# Altium schematic sheet SolenoidValveDriver_v01_Schematic.SchDoc: I2C Solenoid Valve Driver
size A4; URL: sasakaranovic.com/projects/diy-house-plants-watering-system-part-2-central-unit; Distributor: DigiKey
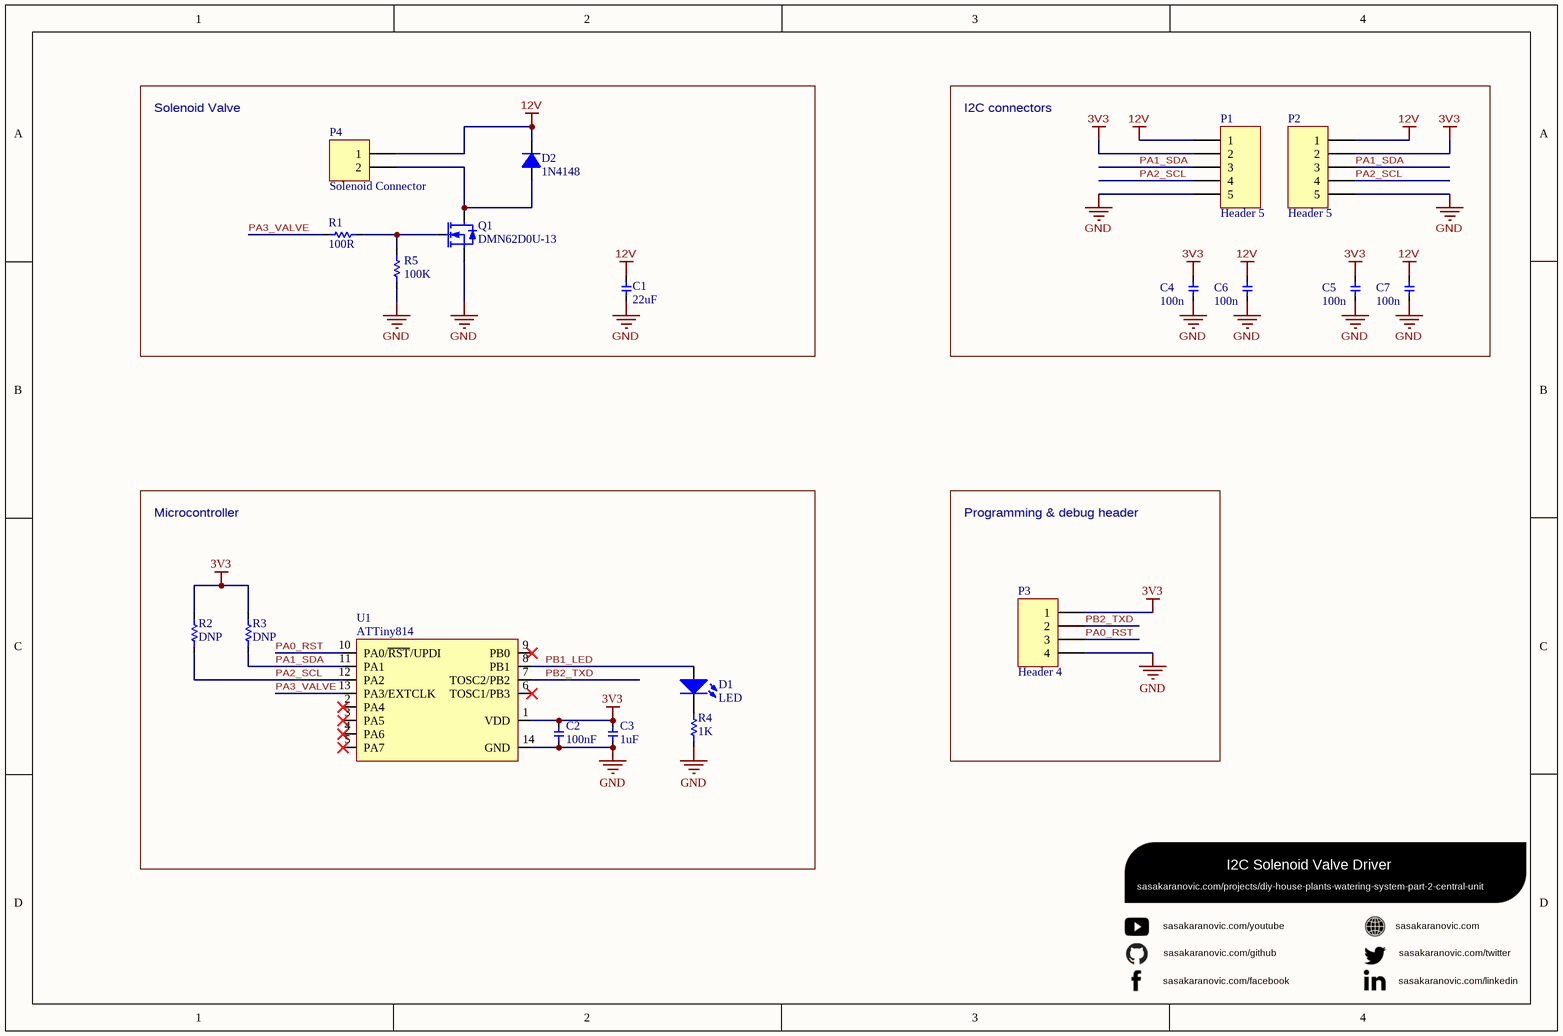
[diagram p0: SolenoidValveDriver_v01_Schematic.SchDoc]

## Parts
C1  value 22uF  [0603 - CAP]  (hidden comment: Cap)
C2  value 100nF  [0603 - CAP]  (hidden comment: Cap)
C3  value 1uF  [0603 - CAP]  (hidden comment: Cap)
C4  value 100n  [0603 - CAP]  (hidden comment: Cap)
C5  value 100n  [0603 - CAP]  (hidden comment: Cap)
C6  value 100n  [0603 - CAP]  (hidden comment: Cap)
C7  value 100n  [0603 - CAP]  (hidden comment: Cap)
D1  LED  [0603 Diode]
D2  1N4148  [SOD123]
P1  Header 5  [Header 5x1]
P2  Header 5  [Header 5x1]
P3  Header 4  [Header 4x1]  (no BOM)
P4  Solenoid Connector  [Header 2x1]
Q1  DMN62D0U-13  [SOT90P240X100-3N]
R1  value 100R  [0603]  (hidden comment: Res)
R2  value DNP  [0603]  (hidden comment: Res)  (no BOM)
R3  value DNP  [0603]  (hidden comment: Res)  (no BOM)
R4  value 1K  [0603]  (hidden comment: Res)
R5  value 100K  [0603]  (hidden comment: Res)
U1  ATTiny814  [SOIC127P600X175-14N]

## Blocks framed on the sheet
Solenoid Valve: C1 D2 P4 Q1 R1 R5
I2C connectors: C4-C7 P1 P2
Microcontroller: C2 C3 D1 R2-R4 U1
Programming & debug header: P3

## Nets
3V3: C2.2 C3.2 C4.2 C5.2 P1.2 P2.2 P3.1 R2.2 R3.2 U1.1(VDD)
12V: C1.2 C6.2 C7.2 D2.K P1.1 P2.1 P4.1
GND: C1.1 C2.1 C3.1 C4.1 C5.1 C6.1 C7.1 P1.5 P2.5 P3.4 Q1.2(S) R4.1 R5.1 U1.14(GND)
PA0_RST: P3.3 U1.10(PA0/~{RST}/UPDI)
PA1_SDA: P1.3 P2.3 R3.1 U1.11(PA1)
PA2_SCL: P1.4 P2.4 R2.1 U1.12(PA2)
PA3_VALVE: R1.1 U1.13(PA3/EXTCLK)
PB1_LED: D1.A U1.8(PB1)
PB2_TXD: P3.2 U1.7(TOSC2/PB2)
NetD1_K: D1.K R4.2
NetD2_A: D2.A P4.2 Q1.3(D)
NetQ1_1: Q1.1(G) R1.2 R5.2

Not connected (* = marked no-connect by the designer): U1 2(PA4)* 3(PA5)* 4(PA6)* 5(PA7)* 6(TOSC1/PB3)* 9(PB0)*

## Notes on the sheet
- sasakaranovic.com/youtube
- sasakaranovic.com
- sasakaranovic.com/github
- sasakaranovic.com/facebook
- sasakaranovic.com/twitter
- sasakaranovic.com/linkedin

## Library data of the parts
C1 = Cap: Capacitor; Manufacturer: Nichicon; Manufacturer Part Number: UVZ1J220MDD1TD; Distributor Part Number: 493-13481-1-ND; Distributor: DigiKey
C2 = Cap: Capacitor; Manufacturer: Samsung Electro-Mechanics; Manufacturer Part Number: CL10B104KB8NNNL; Distributor Part Number: 1276-CL10B104KB8NNNLCT-ND; Distributor: DigiKey
C3 = Cap: Capacitor; Manufacturer: Samsung Electro-Mechanics; Manufacturer Part Number: CL31B105KBHNFNE; Distributor Part Number: 1276-3091-1-ND; Distributor: DigiKey
C4-C7 = Cap: CAP CER 0.1UF 50V X7R 0603; Manufacturer: Samsung Electro-Mechanics; Manufacturer Part Number: CL10B104KB8NNNL; Distributor Part Number: 1276-CL10B104KB8NNNLCT-ND; Distributor: DigiKey
D1 = LED: Typical RED GaAs LED; Manufacturer: Würth Elektronik; Manufacturer Part Number: 150060RS75000; Distributor: DigiKey; Distributor Part Number: 732-4978-1-ND
D2 = Diode: DIODE GEN PURP 100V 300MA SOD123; Manufacturer: Diodes Incorporated; Manufacturer Part Number: 1N4148W-7-F; Distributor: DigiKey; Distributor Part Number: 1N4148W-FDICT-ND
P1 P2 = Header 5: Header, 5-Pin; Manufacturer: Harwin Inc.; Manufacturer Part Number: M20-9960545; Distributor: DigiKey; Distributor Part Number: 952-2246-ND
P3 = Header 4: Header, 4-Pin; Distributor: DigiKey
P4 = Header 2: Header, 2-Pin; Manufacturer: Harwin Inc.; Manufacturer Part Number: M20-9960245; Distributor: DigiKey; Distributor Part Number: 952-2244-ND
Q1 = DMN62D0U-13: MOSFET N-CH 60V 0.38A; Manufacturer: Diodes Incorporated; Manufacturer Part Number: DMN62D0U-13; Distributor: DigiKey; Distributor Part Number: DMN62D0U-13DICT-ND
R1 = Res: RES SMD 0 OHM JUMPER 1/10W 0603; Manufacturer: Yageo; Manufacturer Part Number: AC0603JR-070RL; Distributor: DigiKey; Distributor Part Number: 311-0.0LECT-ND
R2 R3 = Res: Resistor
R4 = Res: Resistor; Manufacturer: Yageo; Manufacturer Part Number: RC0603JR-071KL; Distributor Part Number: 311-1.0KGRCT-ND; Distributor: DigiKey
R5 = Res: RES SMD 1M OHM 5% 1/10W 0603; Manufacturer: Yageo; Manufacturer Part Number: RC0603JR-071ML; Distributor: DigiKey; Distributor Part Number: 311-1.0MGRCT-ND
U1 = ATTiny814: IC MCU 8BIT 8KB FLASH 14SOIC; Manufacturer: Microchip Technology; Manufacturer Part Number: ATTINY814-SSNR; Distributor: DigiKey; Distributor Part Number: ATTINY814-SSNRCT-ND